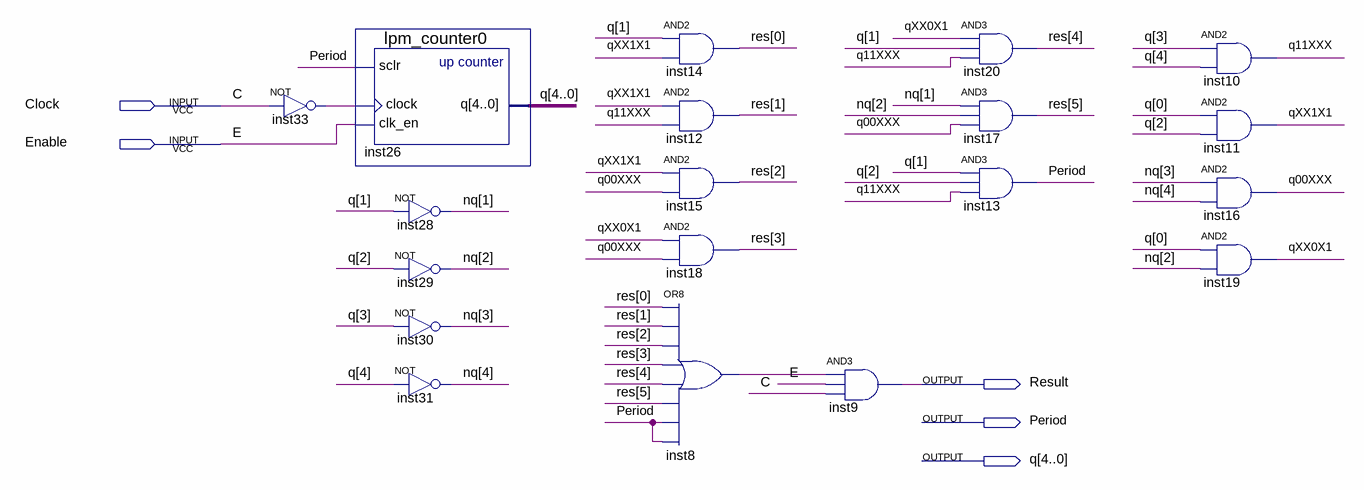
[diagram p0: schematic sheet]
// Quartus schematic counter_logic.bdf as structural Verilog: 19 symbols, 5 pins
module counter_logic (
  input  Clock,
  input  Enable,
  output Result,
  output Period,
  output [4:0] q
);

  wire inst8_out, inst33_out, q00XXX, q11XXX, qXX0X1, qXX1X1;
  wire [4:1] nq;
  wire [5:0] res;

  not inst33 (inst33_out, Clock);
  lpm_counter0 inst26 (.sclr(Period), .clock(inst33_out), .clk_en(Enable), .q(q));
  not inst28 (nq[1], q[1]);
  not inst29 (nq[2], q[2]);
  not inst30 (nq[3], q[3]);
  not inst31 (nq[4], q[4]);
  and inst14 (res[0], q[1], qXX1X1);
  and inst12 (res[1], qXX1X1, q11XXX);
  and inst15 (res[2], qXX1X1, q00XXX);
  and inst18 (res[3], qXX0X1, q00XXX);
  or inst8 (inst8_out, res[0], res[1], res[2], res[3], res[4], res[5], Period, Period);
  and inst9 (Result, inst8_out, Enable, Clock);
  and inst20 (res[4], qXX0X1, q[1], q11XXX);
  and inst17 (res[5], nq[1], nq[2], q00XXX);
  and inst13 (Period, q[1], q[2], q11XXX);
  and inst10 (q11XXX, q[3], q[4]);
  and inst11 (qXX1X1, q[0], q[2]);
  and inst16 (q00XXX, nq[3], nq[4]);
  and inst19 (qXX0X1, q[0], nq[2]);

  // Other names for the same wires on the sheet: C = Clock; E = Enable
endmodule
